# EAGLE design M161 (EAGLE 6.6.0)
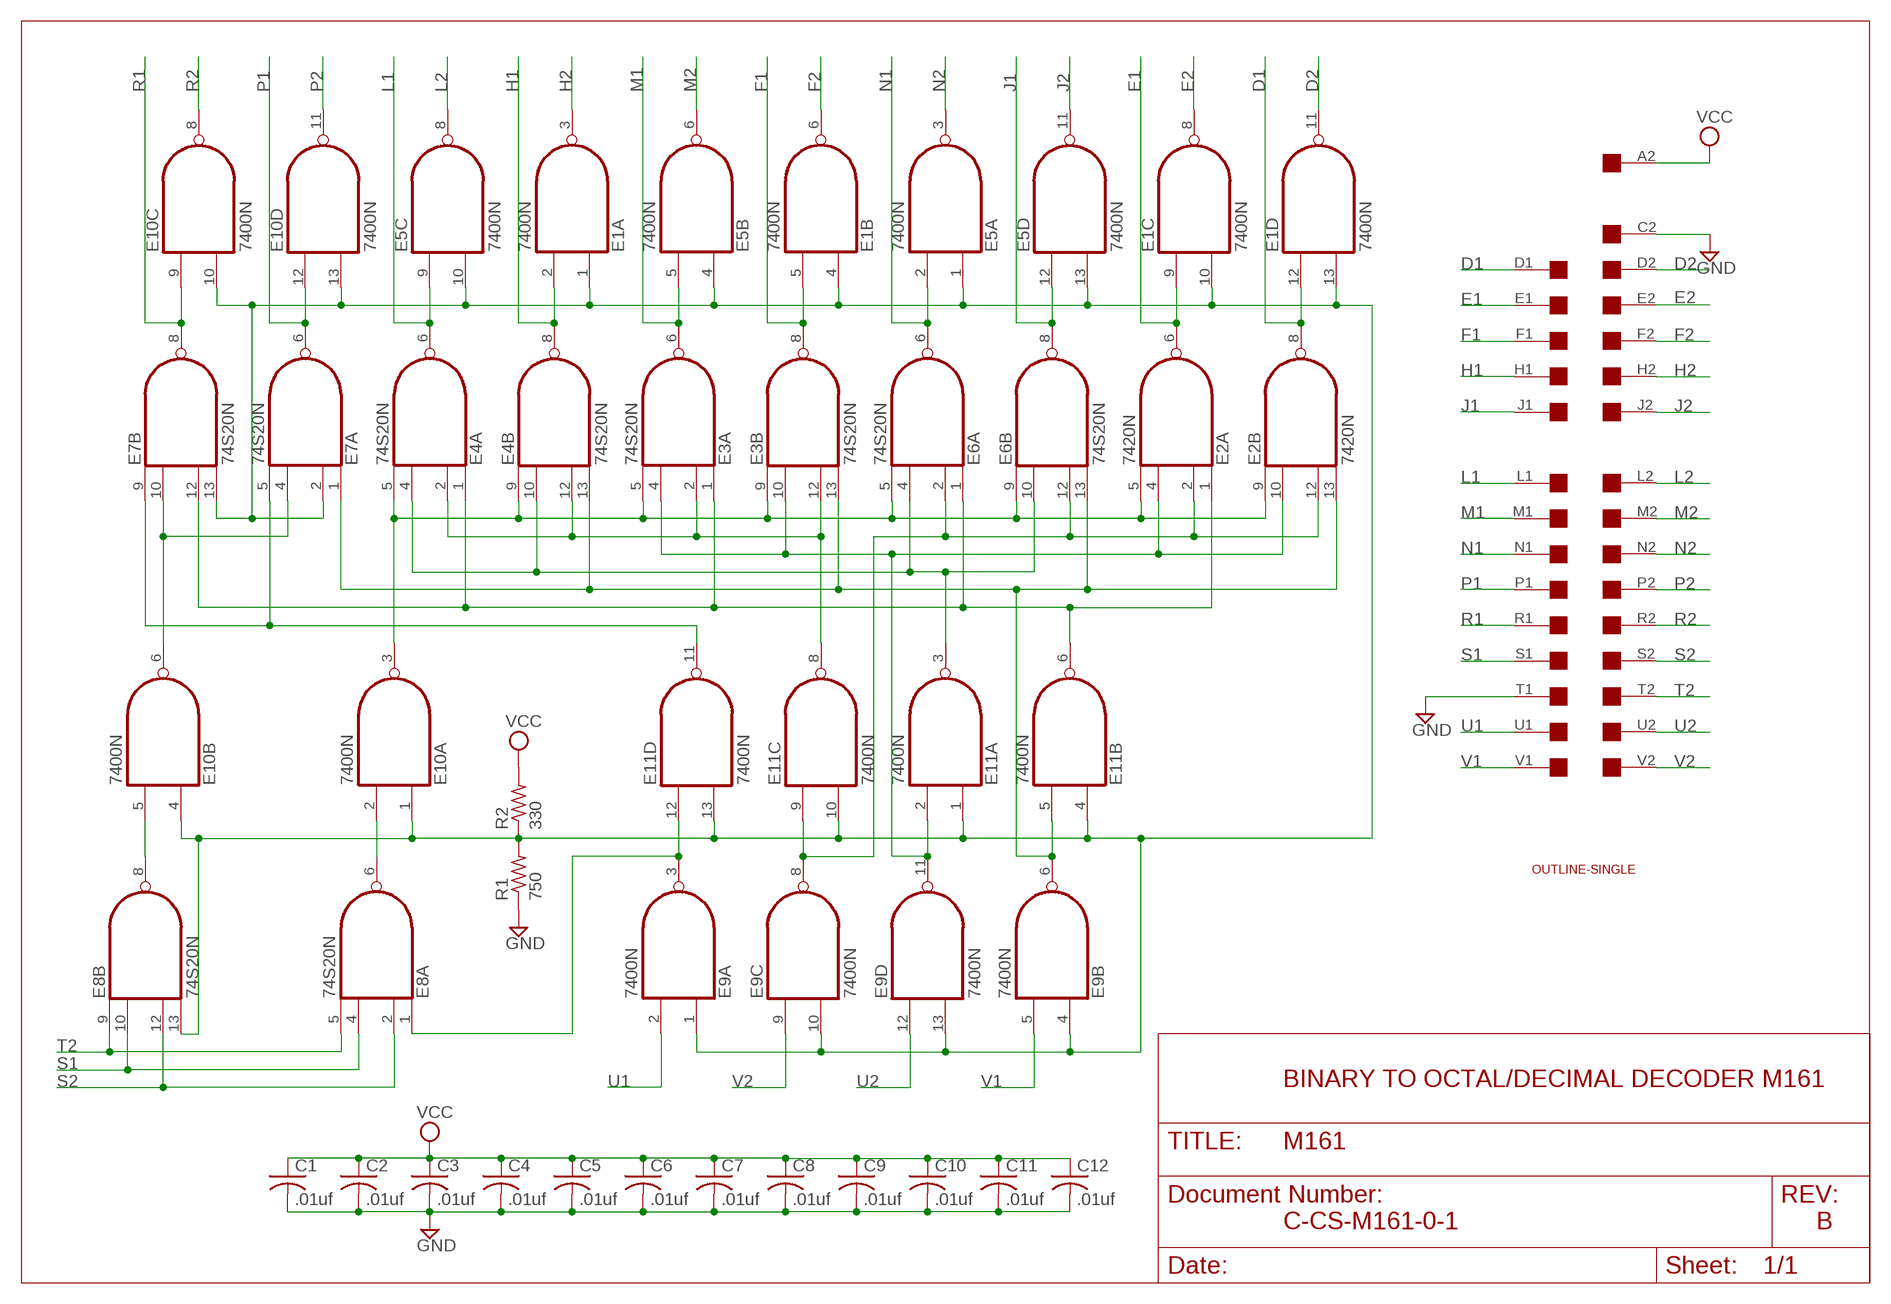
[diagram p0: schematic, sheet 1]

## Parts
C1  .01uf  C-US050-025X075  [C050-025X075]
C2  .01uf  C-US050-025X075  [C050-025X075]
C3  .01uf  C-US050-025X075  [C050-025X075]
C4  .01uf  C-US050-025X075  [C050-025X075]
C5  .01uf  C-US050-025X075  [C050-025X075]
C6  .01uf  C-US050-025X075  [C050-025X075]
C7  .01uf  C-US050-025X075  [C050-025X075]
C8  .01uf  C-US050-025X075  [C050-025X075]
C9  .01uf  C-US050-025X075  [C050-025X075]
C10  .01uf  C-US050-025X075  [C050-025X075]
C11  .01uf  C-US050-025X075  [C050-025X075]
C12  .01uf  C-US050-025X075  [C050-025X075]
E1  7400N  [DIL14]
E2  7420N  74S20N  [DIL14]
E3  74S20N  [DIL14]
E4  74S20N  [DIL14]
E5  7400N  [DIL14]
E6  74S20N  [DIL14]
E7  74S20N  [DIL14]
E8  74S20N  [DIL14]
E9  7400N  [DIL14]
E10  7400N  [DIL14]
E11  7400N  [DIL14]
R1  750  R-US_0207/10  [0207/10]
R2  330  R-US_0207/10  [0207/10]
U$1  OUTLINE-SINGLE  [SINGLE]
U$4  SINGLE  [EDGE-CON2]

## Nets
D1: E1.12(D:I0) E2.8(B:O) U$4.D1
D2: E1.11(D:O) U$4.D2
E1: E1.9(C:I0) E2.6(A:O) U$4.E1
E2: E1.8(C:O) U$4.E2
F1: E1.5(B:I1) E3.8(B:O) U$4.F1
F2: E1.6(B:O) U$4.F2
GND [power]: C1.2 C2.2 C3.2 C4.2 C5.2 C6.2 C7.2 C8.2 C9.2 C10.2 C11.2 C12.2 R1.1 U$4.C2 U$4.T1
H1: E1.2(A:I1) E4.8(B:O) U$4.H1
H2: E1.3(A:O) U$4.H2
J1: E5.12(D:I0) E6.8(B:O) U$4.J1
J2: E5.11(D:O) U$4.J2
L1: E4.6(A:O) E5.9(C:I0) U$4.L1
L2: E5.8(C:O) U$4.L2
M1: E3.6(A:O) E5.5(B:I1) U$4.M1
M2: E5.6(B:O) U$4.M2
N1: E5.2(A:I1) E6.6(A:O) U$4.N1
N2: E5.3(A:O) U$4.N2
N$1: E1.1(A:I0) E1.4(B:I0) E1.10(C:I1) E1.13(D:I1) E5.1(A:I0) E5.4(B:I0) E5.10(C:I1) E5.13(D:I1) E7.2(A:I1) E7.13(B:I3) E8.13(B:I3) E9.1(A:I0) E9.4(B:I0) E9.10(C:I1) E9.13(D:I1) E10.1(A:I0) E10.4(B:I0) E10.10(C:I1) E10.13(D:I1) E11.1(A:I0) E11.4(B:I0) E11.10(C:I1) E11.13(D:I1) R1.2 R2.1
N$2: E8.8(B:O) E10.5(B:I1)
N$4: E7.4(A:I2) E7.10(B:I1) E10.6(B:O)
N$5: E2.5(A:I3) E2.9(B:I0) E3.5(A:I3) E3.9(B:I0) E4.5(A:I3) E4.9(B:I0) E6.5(A:I3) E6.9(B:I0) E10.3(A:O)
N$6: E8.6(A:O) E10.2(A:I1)
N$7: E8.1(A:I0) E9.3(A:O) E11.12(D:I0)
N$8: E2.2(A:I1) E2.12(B:I2) E6.2(A:I1) E6.12(B:I2) E9.8(C:O) E11.9(C:I0)
N$9: E2.4(A:I2) E2.10(B:I1) E3.4(A:I2) E3.10(B:I1) E9.11(D:O) E11.2(A:I1)
N$10: E2.13(B:I3) E3.13(B:I3) E4.13(B:I3) E6.13(B:I3) E7.1(A:I0) E9.6(B:O) E11.5(B:I1)
N$11: E3.2(A:I1) E3.12(B:I2) E4.2(A:I1) E4.12(B:I2) E11.8(C:O)
N$12: E7.5(A:I3) E7.9(B:I0) E11.11(D:O)
N$24: E4.4(A:I2) E4.10(B:I1) E6.4(A:I2) E6.10(B:I1) E11.3(A:O)
N$25: E2.1(A:I0) E3.1(A:I0) E4.1(A:I0) E6.1(A:I0) E7.12(B:I2) E11.6(B:O)
P1: E7.6(A:O) E10.12(D:I0) U$4.P1
P2: E10.11(D:O) U$4.P2
R1: E7.8(B:O) E10.9(C:I0) U$4.R1
R2: E10.8(C:O) U$4.R2
S1: E8.4(A:I2) E8.10(B:I1) U$4.S1
S2: E8.2(A:I1) E8.12(B:I2) U$4.S2
T2: E8.5(A:I3) E8.9(B:I0) U$4.T2
U1: E9.2(A:I1) U$4.U1
U2: E9.12(D:I0) U$4.U2
V1: E9.5(B:I1) U$4.V1
V2: E9.9(C:I0) U$4.V2
VCC [power]: C1.1 C2.1 C3.1 C4.1 C5.1 C6.1 C7.1 C8.1 C9.1 C10.1 C11.1 C12.1 R2.2 U$4.A2
Unconnected: U$4.A1 U$4.B1 U$4.B2 U$4.C1 U$4.K1 U$4.K2

## Notes on the sheet
- BINARY TO OCTAL/DECIMAL DECODER M161
- C-CS-M161-0-1 | B

## Power pins joined to a net without a drawn wire
GND: E1.7(P:GND) E2.7(P:GND) E3.7(P:GND) E4.7(P:GND) E5.7(P:GND) E6.7(P:GND) E7.7(P:GND) E8.7(P:GND) E9.7(P:GND) E10.7(P:GND) E11.7(P:GND)
VCC: E1.14(P:VCC) E2.14(P:VCC) E3.14(P:VCC) E4.14(P:VCC) E5.14(P:VCC) E6.14(P:VCC) E7.14(P:VCC) E8.14(P:VCC) E9.14(P:VCC) E10.14(P:VCC) E11.14(P:VCC)

## Library data of the parts
C1-C12 = rcl:C-US: CAPACITOR, American symbol
E1 E5 E9-E11 = 74xx-us:74*00: Quad 2-input NAND gate
E2-E4 E6-E8 = 74xx-us:74*20: Dual 4-input NAND gate
R1 R2 = rcl:R-US_: RESISTOR, American symbol
U$1 = dec-con:OUTLINE-*: Board outlines for DEC boards.
U$4 = dec-con:SINGLE: Single-Height DEC board

## Net classes
0 default: width 0.381 mm
1 power: width 0.813 mm

## Board
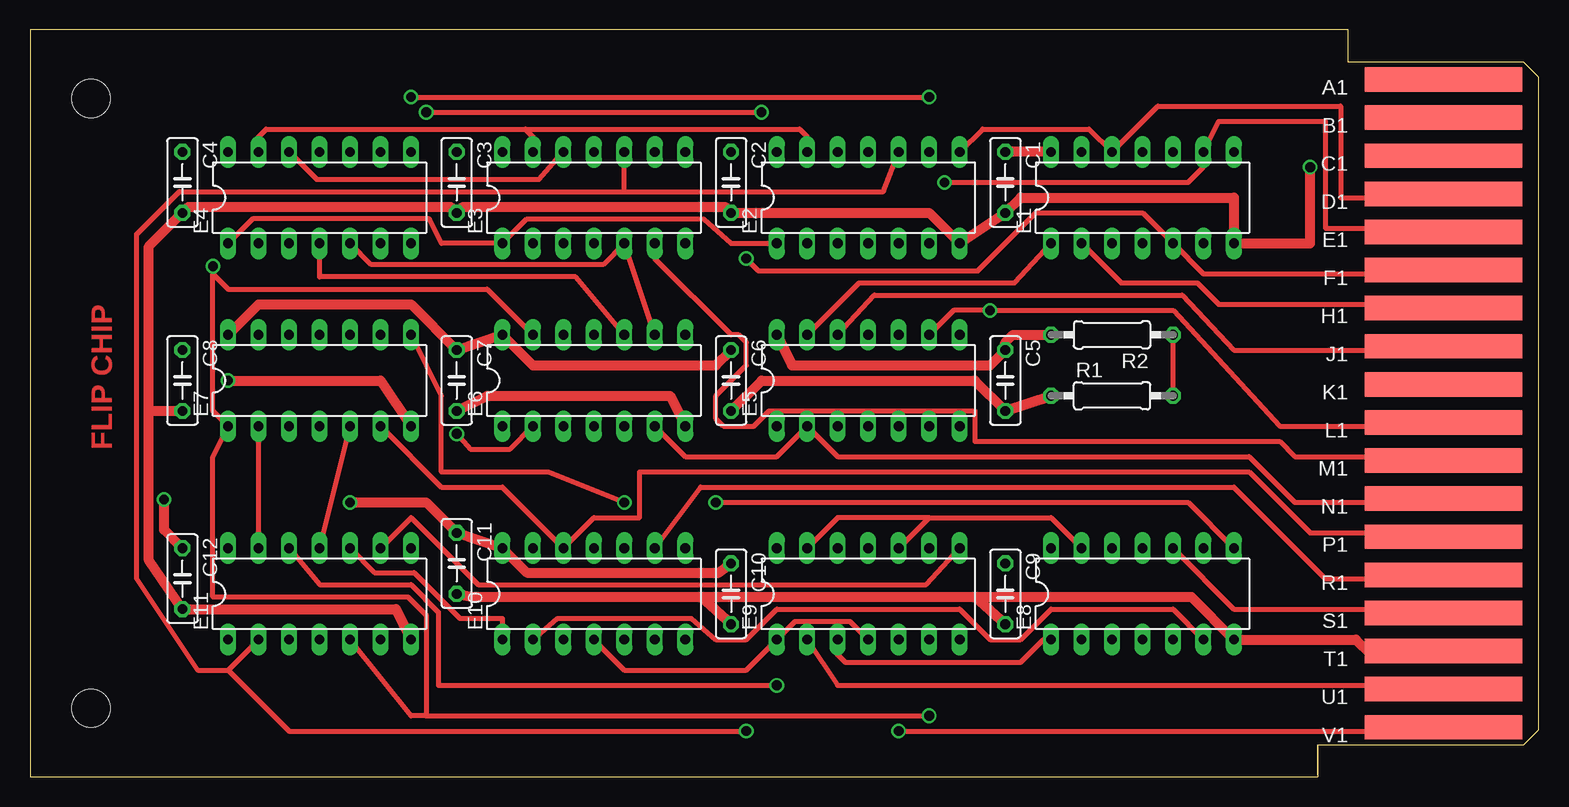
[diagram p1: board, top side]
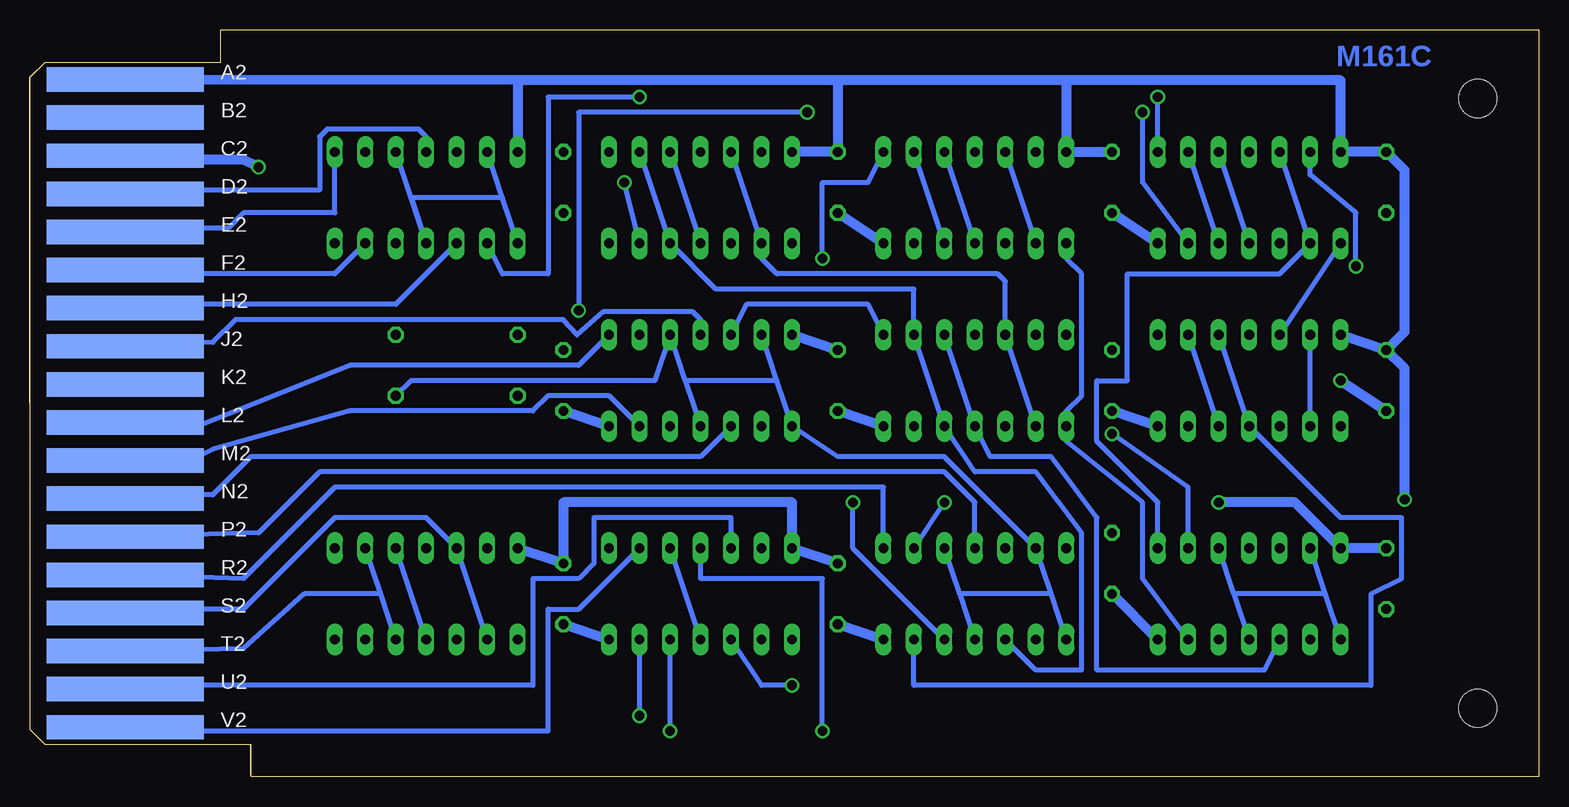
[diagram p2: board, bottom side, seen from below]

Size 125.73 x 62.23 mm. Coordinates in mm from the lower left corner, seen from the top.
Copper layers (1+16): Top 0.035mm / dielectric 1.5mm / Bottom 0.035mm
Design rules "16mils": minimum track width 16mil, minimum drill 32mil, track to track 15mil, track to pad 10mil, pad to pad 10mil, via to via 10mil, smd to smd 10mil, copper to edge 13mil, drill to drill 10mil, minimum pad ring 10mil, minimum via ring 8mil, stop-mask expansion 0mil, vias tented up to drill 0mil, thermal gap 10mil

### Footprints (pad centres in the part's own frame; a part is rotated, then mirrored left to right if it is on the bottom)
C050-025X075 = drill 0.813 octagon: 1 -2.54,0; 2 2.54,0
DIL14 = drill 0.813 long: 1 -7.62,-3.81; 2 -5.08,-3.81; 3 -2.54,-3.81; 4 0,-3.81; 5 2.54,-3.81; 6 5.08,-3.81; 7 7.62,-3.81; 8 7.62,3.81; 9 5.08,3.81; 10 2.54,3.81; 11 0,3.81; 12 -2.54,3.81; 13 -5.08,3.81; 14 -7.62,3.81
0207/10 = drill 0.813 octagon: 1 -5.08,0; 2 5.08,0
SINGLE = hole 3.175: 120.65,56.515; 120.65,5.715
EDGE-CON2 = smd 13.106 x 2.032: A1 7.938,4.128; B1 7.938,7.303; C1 7.938,10.477; D1 7.938,13.652; E1 7.938,16.828; F1 7.938,20.003; H1 7.938,23.177; J1 7.938,26.352; K1 7.938,29.527; L1 7.938,32.703; M1 7.938,35.877; N1 7.938,39.053; P1 7.938,42.227; R1 7.938,45.403; S1 7.938,48.578; T1 7.938,51.752; U1 7.938,54.928; V1 7.938,58.102 | smd 13.106 x 2.032 bottom: A2 7.938,4.128; B2 7.938,7.303; C2 7.938,10.477; D2 7.938,13.652; E2 7.938,16.828; F2 7.938,20.003; H2 7.938,23.177; J2 7.938,26.352; K2 7.938,29.527; L2 7.938,32.703; M2 7.938,35.877; N2 7.938,39.053; P2 7.938,42.227; R2 7.938,45.403; S2 7.938,48.578; T2 7.938,51.752; U2 7.938,54.928; V2 7.938,58.102

### Placement (x,y rotation side)
C1  81.28,49.53 270 top
C2  58.42,49.53 270 top
C3  35.56,49.53 270 top
C4  12.7,49.53 270 top
C5  81.28,33.02 270 top
C6  58.42,33.02 270 top
C7  35.56,33.02 270 top
C8  12.7,33.02 270 top
C9  81.28,15.24 270 top
C10  58.42,15.24 270 top
C11  35.56,17.78 270 top
C12  12.7,16.51 270 top
E1  92.71,48.26 0 top
E2  69.85,48.26 0 top
E3  46.99,48.26 0 top
E4  24.13,48.26 0 top
E5  69.85,33.02 0 top
E6  46.99,33.02 0 top
E7  24.13,33.02 0 top
E8  92.71,15.24 0 top
E9  69.85,15.24 0 top
E10  46.99,15.24 0 top
E11  24.13,15.24 0 top
R1  90.17,31.75 0 top
R2  90.17,36.83 180 top
U$1  125.73,62.23 180 top
U$4  125.73,62.23 180 top

### Tracks (layer width: path | path; a pad name or v marks a point on that pad's centre or on a via)
D1
  Top 0.406: E2.8 79.38,53.98 88.27,53.98 E1.12 93.98,55.88 109.22,55.88 109.22,48.26 118.11,48.26 U$4.D1
D2
  Bottom 0.406: E1.11 92.71,53.34 93.34,53.98 100.97,53.98 101.6,53.34 101.6,48.9 111.76,48.9 U$4.D2
E1  (via drill 0.81)
  Top 0.406: U$4.E1 118.11,45.72 107.95,45.72 107.95,54.61 99.06,54.61 E1.9 97.79,50.8 96.52,49.53 v76.2,49.53
  Bottom 0.406: E2.6 v76.2,49.53
E2
  Bottom 0.406: E1.8 100.33,46.99 107.95,46.99 109.22,45.72 118.11,45.72 U$4.E2
F1  (via drill 0.81)
  Top 0.406: U$4.F1 118.11,41.91 97.79,41.91 E1.5 92.71,46.99 83.82,46.99 78.99,42.16 60.71,42.16 v59.69,43.18
  Bottom 0.406: v59.69,43.18 59.69,49.53 55.88,49.53 E3.8
F2
  Bottom 0.406: E1.6 100.33,41.91 118.11,41.91 U$4.F2
GND  (via drill 0.81)
  Top 0.813: U$4.T1 111.76,10.16 110.49,11.43 E8.7 96.77,14.99 78.74,14.99 | v106.68,50.8 106.68,44.45 E1.7 100.33,48.26 82.55,48.26 C1.2 E2.7 74.93,46.99 C2.2 57.91,47.5 36.07,47.5 C3.2 35.05,47.5 13.21,47.5 C4.2 9.91,44.2 9.91,30.48 | 9.91,30.48 9.91,18.03 C12.2 30.48,13.97 E11.7 | 9.91,30.48 C8.2 | R1.1 C5.2 78.74,33.02 60.96,33.02 C6.2 | C11.2 36.83,14.99 55.88,14.99 | 55.88,14.99 C10.2 | 78.74,14.99 C9.2 | 55.88,14.99 78.74,14.99 | C7.2 38.1,31.75 53.34,31.75 E6.7 | v16.51,33.02 29.21,33.02 E7.7
  Bottom 0.813: v106.68,50.8 107.95,51.44 111.76,51.44 U$4.C2 | C2.2 E3.7 | E7.7 C7.2 | E6.7 C6.2 | C5.2 E5.7 | E11.7 C11.2 | C10.2 E10.7 | C9.2 E9.7 | C3.2 E4.7 | C8.2 v16.51,33.02
H1  (via drill 0.81)
  Top 0.406: E1.2 90.93,41.15 97.28,41.15 99.06,39.37 118.11,39.37 U$4.H1 | v31.75,56.64 v74.93,56.64
  Bottom 0.406: E4.8 v31.75,56.64 | v74.93,56.64 82.55,56.64 82.55,41.91 86.36,41.91 E1.2
H2
  Bottom 0.406: E1.3 95.25,39.37 112.39,39.37 U$4.H2
J1
  Top 0.406: E5.12 70.36,40.13 96.01,40.13 100.33,35.56 118.11,35.56 U$4.J1
  Bottom 0.406: E6.8 55.88,39.37 66.04,39.37 E5.12
J2
  Bottom 0.406: E5.11 69.85,38.1 70.48,38.73 77.98,38.73 80.14,36.83 81.28,38.1 108.58,38.1 110.49,36.2 U$4.J2
L1  (via drill 0.81)
  Top 0.406: E5.9 76.96,38.86 v80.01,38.86 95.25,38.86 104.14,29.21 118.11,29.21 U$4.L1 | v33.02,55.37 v60.96,55.37
  Bottom 0.406: E4.6 33.02,49.53 v33.02,55.37 | v60.96,55.37 80.01,55.37 v80.01,38.86
L2
  Bottom 0.406: E5.8 80.01,34.29 99.06,34.29 111.76,29.21 118.11,29.21 U$4.L2
M1
  Top 0.406: 72.39,30.48 E5.5 | U$4.M1 118.11,26.67 105.41,26.67 104.14,27.94 78.74,27.94 78.74,30.48 72.39,30.48 | 72.39,30.48 61.59,30.48 60.33,29.21 57.78,29.21 57.15,29.84 57.15,31.75 59.69,34.29 59.69,36.2 59.05,36.83 58.42,36.83 52.07,43.18 E3.6
M2
  Bottom 0.406: U$4.M2 111.76,26.67 110.49,27.3 99.06,30.48 83.82,30.48 82.55,31.75 77.47,31.75 E5.6
N1
  Top 0.406: U$4.N1 118.11,22.86 105.41,22.86 101.6,26.67 67.31,26.67 E5.2 62.23,26.67 54.61,26.67 E6.6
N2
  Bottom 0.406: E5.3 69.85,26.67 107.31,26.67 110.49,23.5 111.76,23.5 U$4.N2
N$1
  Top 0.406: R1.2 R2.1 | E11.13 E7.2 | E9.10 74.93,21.59 | 74.93,21.59 85.09,21.59 E8.13 | E9.13 67.31,21.59 74.93,21.59 | E5.13 69.09,41.15 82.04,41.15 E1.1 | E11.10 28.7,17.02 32,17.02 35.81,13.21 39.37,13.21 E10.1 | E10.4 49.53,8.89 59.69,8.89 E9.1 63.75,12.95 68.33,12.95 E9.4
  Bottom 0.406: E7.2 E7.13 | 86.36,48.26 E1.13 | E1.1 86.36,48.26 | E1.10 E1.4 93.98,48.26 86.36,48.26 | 63.5,33.02 E5.13 | 63.5,33.02 E5.1 58.42,26.67 49.53,26.67 E10.13 40.64,15.24 | 71.12,33.02 E5.4 | 63.5,33.02 71.12,33.02 | 71.12,33.02 E5.10 73.66,33.02 93.98,33.02 R1.2 | 17.78,15.24 E11.13 | E11.1 17.78,15.24 | 25.4,15.24 E11.4 | 17.78,15.24 25.4,15.24 | 25.4,15.24 E11.10 | E10.1 40.64,15.24 | 48.26,15.24 E10.4 | 40.64,15.24 48.26,15.24 | 48.26,15.24 E10.10 | E9.4 E9.10
N$2  (via drill 0.81)
  Top 0.406: E8.8 96.52,22.86 v57.15,22.86
  Bottom 0.406: v57.15,22.86 57.15,19.05 E10.5
N$4
  Bottom 0.406: E7.10 E7.4 16.51,21.59 11.43,21.59 11.43,16.51 13.97,15.24 13.97,7.62 52.07,7.62 E10.6
N$5
  Top 0.406: E4.5 28.45,42.67 47.75,42.67 E3.5 E6.9
  Bottom 0.406: E2.9 E2.5 68.58,40.64 52.07,40.64 E6.9 E6.5 46.99,25.4 41.91,25.4 38.1,20.32 38.1,8.89 41.91,8.89 E10.3 | E3.5 E3.9 | E4.5 E4.9
N$6
  Top 0.406: E10.2 43.94,13.21 55.12,13.21 57.15,11.43 59.69,11.43 62.23,13.97 77.47,13.97 80.01,11.43 82.55,11.43 85.09,13.97 95.25,13.97 E8.6
N$7  (via drill 0.81)
  Top 0.406: E8.1 84.45,11.43 82.55,9.53 67.94,9.53 67.31,10.16 E9.3 | E11.12 24.13,16 31.75,16 34.04,13.72 34.04,7.62 v62.23,7.62
  Bottom 0.406: v62.23,7.62 64.77,7.62 E9.3
N$8  (via drill 0.81)
  Top 0.406: v35.56,28.57 36.7,27.3 40.01,27.3 E6.2 | E9.8 74.68,16 37.34,16 31.75,21.59 E11.9
  Bottom 0.406: v35.56,28.57 29.21,24.13 E11.9 | E2.12 E2.2 64.77,43.18 63.5,41.91 45.09,41.91 44.45,41.27 E6.12 E6.2
N$9  (via drill 0.81)
  Top 0.406: 16.51,8.89 E11.2 | 16.51,8.89 13.97,8.89 8.89,16.51 8.89,45.21 12.45,48.77 49.53,48.77 | 49.53,48.77 E3.10 | 49.53,48.77 71.12,48.77 E2.10 | v59.69,3.81 21.59,3.81 16.51,8.89
  Bottom 0.406: E2.10 E2.4 | E3.10 E3.4 | v59.69,3.81 59.69,16.51 69.85,16.51 E9.11
N$10  (via drill 0.81)
  Top 0.406: 41.27,53.98 41.91,53.34 E3.13 | 41.27,53.98 19.68,53.98 19.05,53.34 E4.13 | 41.27,53.98 64.14,53.98 64.77,53.34 E2.13 | 15.24,41.91 15.24,30.48 E7.1 15.24,26.67 15.24,14.99 31.5,14.99 33.02,13.46 33.02,5.08 | 15.24,41.91 v15.24,42.55 | 33.02,5.08 31.75,5.08 E11.5 | 33.02,5.08 v74.93,5.08 | E6.13 38.1,40.64 16.51,40.64 15.24,41.91
  Bottom 0.406: v15.24,42.55 15.24,46.99 19.05,50.16 E4.13 | v74.93,5.08 E9.6
N$11
  Top 0.406: E4.12 23.88,49.78 42.42,49.78 E3.12
  Bottom 0.406: E3.12 E3.2 | E4.12 E4.2 21.59,41.91 34.29,41.91 34.29,33.02 36.83,33.02 36.83,27.94 31.75,22.86 E11.8
N$12
  Top 0.406: E11.11 E7.5
  Bottom 0.406: E7.5 E7.9
N$24
  Top 0.406: E4.4 24.13,41.66 45.47,41.66 E6.10
  Bottom 0.406: E4.4 E4.10 | E6.10 E6.4 45.72,26.67 40.64,26.67 36.83,21.59 36.83,8.89 22.86,8.89 E11.3
N$25
  Top 0.406: E4.1 18.54,46.48 33.27,46.48 34.29,44.45 E3.1 41.4,46.48 56.13,46.48 58.42,44.45 E2.1
  Bottom 0.406: E3.1 39.37,43.18 38.1,41.91 38.1,31.75 39.37,30.48 E6.1 39.37,27.94 33.02,22.86 33.02,16.51 E11.6 | E4.1 E7.12
P1
  Top 0.406: E7.6 34.29,24.13 39.37,24.13 E10.12 46.99,21.59 50.8,21.59 50.8,25.4 101.6,25.4 106.68,20.32 118.11,20.32 U$4.P1
P2
  Bottom 0.406: U$4.P2 106.68,20.32 101.6,25.4 49.53,25.4 46.99,22.86 E10.11
R1  (via drill 0.81)
  Top 0.406: E10.9 55.88,24.13 100.33,24.13 107.95,16.51 118.11,16.51 U$4.R1 | v49.53,22.86 43.18,25.4 34.29,25.4 34.29,31.75 E7.8
  Bottom 0.406: v49.53,22.86 E10.9
R2
  Bottom 0.406: U$4.R2 107.95,16.51 100.33,24.13 54.61,24.13 E10.8
S1
  Top 0.406: U$4.S1 111.76,13.97 100.33,13.97 E8.10
  Bottom 0.406: E8.4 E8.10
S2
  Bottom 0.406: E8.2 E8.12 92.71,21.59 100.33,21.59 107.95,13.97 118.11,13.97 U$4.S2
T2
  Bottom 0.406: 96.52,15.24 E8.9 | E8.5 96.52,15.24 | U$4.T2 107.95,10.67 102.87,15.24 96.52,15.24
U1
  Top 0.406: E9.2 67.31,7.62 118.11,7.62 U$4.U1
U2
  Bottom 0.406: E9.12 67.31,21.59 78.74,21.59 78.74,17.78 80.01,16.51 83.82,16.51 83.82,7.62 118.11,7.62 U$4.U2
V1  (via drill 0.81)
  Top 0.406: v72.39,3.81 111.76,3.81 U$4.V1
  Bottom 0.406: v72.39,3.81 E9.5
V2
  Bottom 0.406: E9.9 80.01,13.97 82.55,13.97 82.55,3.81 118.11,3.81 U$4.V2
VCC  (via drill 0.81)
  Top 0.813: R2.2 81.92,36.83 81.28,36.2 C5.1 80.01,34.29 63.5,34.29 E5.14 | E1.14 C1.1 | v11.18,23.11 11.18,20.57 C12.1 | E7.14 19.05,39.37 31.75,39.37 C7.1 E6.14 41.91,34.29 57.15,34.29 C6.1 | v26.67,22.86 33.02,22.86 C11.1 E10.14 41.4,17.02 57.4,17.02 C10.1
  Bottom 0.813: 39.37,58.02 16.51,58.02 E4.14 C4.1 11.18,50.55 11.18,37.08 C8.1 | 39.37,58.02 58.42,58.02 | 58.42,58.02 85.09,58.02 | 85.09,58.02 U$4.A2 | 39.37,58.02 E3.14 C3.1 | E2.14 C2.1 58.42,58.02 | 85.09,58.02 E1.14 | C8.1 E7.14 | C8.1 11.18,34.04 v11.18,23.11 | C12.1 E11.14 20.32,22.86 v26.67,22.86 | C10.1 E9.14 62.23,22.86 81.28,22.86 C9.1 E8.14 | C6.1 E5.14

### Text on the board
Top: FLIP CHIP
Bottom: M161C